# Altium schematic sheet PMIC_Debug.SchDoc
size 420 x 297 mm; SheetNumber: 15; SheetTotal: 21
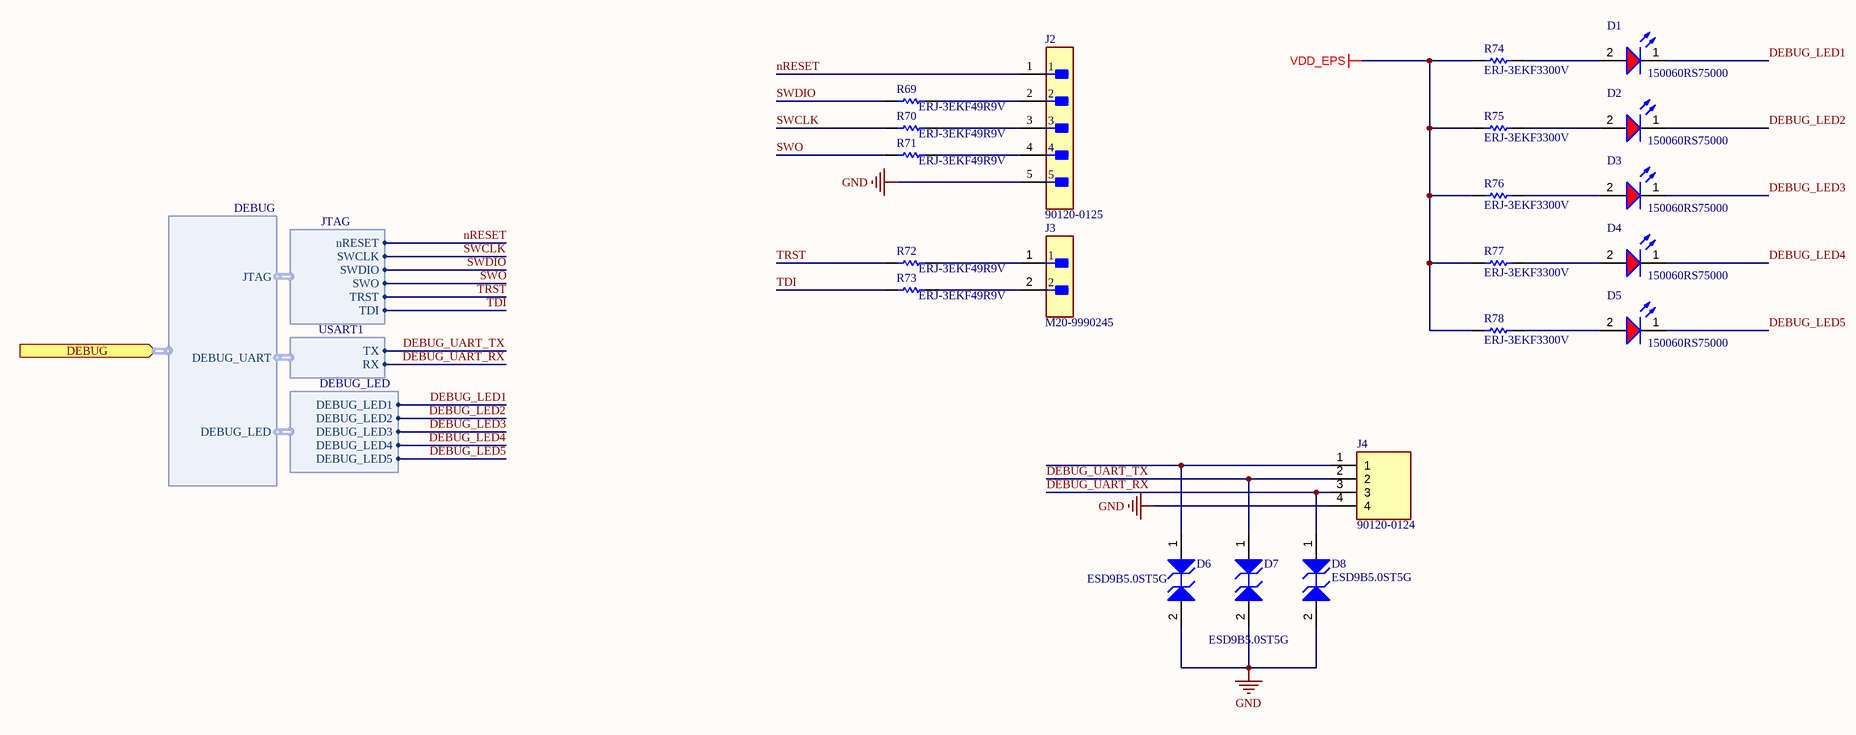
[diagram p0: PMIC_Debug.SchDoc]

## Parts
D1  150060RS75000  [WL-SMCW_0603_150060xx75000]
D2  150060RS75000  [WL-SMCW_0603_150060xx75000]
D3  150060RS75000  [WL-SMCW_0603_150060xx75000]
D4  150060RS75000  [WL-SMCW_0603_150060xx75000]
D5  150060RS75000  [WL-SMCW_0603_150060xx75000]
D6  ESD9B5.0ST5G  [ONSC-SOD-923-2-514AB-01_V]
D7  ESD9B5.0ST5G  [ONSC-SOD-923-2-514AB-01_V]
D8  ESD9B5.0ST5G  [ONSC-SOD-923-2-514AB-01_V]
J2  90120-0125  [FP-90120-0125-MFG]
J3  M20-9990245  [FP-M20-9990245-MFG]
J4  90120-0124  [HDRV4W65P0X254_1X4_1016X254X945P]
R69  ERJ-3EKF49R9V  [RESC1608X55X30ML15T15]
R70  ERJ-3EKF49R9V  [RESC1608X55X30ML15T15]
R71  ERJ-3EKF49R9V  [RESC1608X55X30ML15T15]
R72  ERJ-3EKF49R9V  [RESC1608X55X30ML15T15]
R73  ERJ-3EKF49R9V  [RESC1608X55X30ML15T15]
R74  ERJ-3EKF3300V  [RESC1608X55X30LL15T15]
R75  ERJ-3EKF3300V  [RESC1608X55X30LL15T15]
R76  ERJ-3EKF3300V  [RESC1608X55X30LL15T15]
R77  ERJ-3EKF3300V  [RESC1608X55X30LL15T15]
R78  ERJ-3EKF3300V  [RESC1608X55X30LL15T15]

## Ports
DEBUG (in, harness DEBUG)

## Harnesses
DEBUG: JTAG, DEBUG_UART, DEBUG_LED
JTAG: nRESET, SWCLK, SWDIO, SWO, TDI, TRST
USART1: TX, RX
DEBUG_LED: DEBUG_LED1, DEBUG_LED2, DEBUG_LED3, DEBUG_LED4, DEBUG_LED5

## Nets
GND: D6.2(A2) D7.2(A2) D8.2(A2) J2.5 J4.4
VDD_EPS: R74.1 R75.1 R76.1 R77.1 R78.1
DEBUG_LED1: D1.1(K) ; harness DEBUG_LED.DEBUG_LED1
DEBUG_LED2: D2.1(K) ; harness DEBUG_LED.DEBUG_LED2
DEBUG_LED3: D3.1(K) ; harness DEBUG_LED.DEBUG_LED3
DEBUG_LED4: D4.1(K) ; harness DEBUG_LED.DEBUG_LED4
DEBUG_LED5: D5.1(K) ; harness DEBUG_LED.DEBUG_LED5
DEBUG_UART_RX: D8.1(A1) J4.3 ; harness USART1.RX
DEBUG_UART_TX: D7.1(A1) J4.2 ; harness USART1.TX
nRESET: J2.1 ; harness JTAG.nRESET
SWCLK: R70.1 ; harness JTAG.SWCLK
SWDIO: R69.1 ; harness JTAG.SWDIO
SWO: R71.1 ; harness JTAG.SWO
TDI: R73.1 ; harness JTAG.TDI
TRST: R72.1 ; harness JTAG.TRST
NetD1_2: D1.2(A) R74.2
NetD2_2: D2.2(A) R75.2
NetD3_2: D3.2(A) R76.2
NetD4_2: D4.2(A) R77.2
NetD5_2: D5.2(A) R78.2
NetD6_1: D6.1(A1) J4.1
NetJ2_2: J2.2 R69.2
NetJ2_3: J2.3 R70.2
NetJ2_4: J2.4 R71.2
NetJ3_1: J3.1 R72.2
NetJ3_2: J3.2 R73.2

## Notes on the sheet
- THIS DOCUMENT AND THE DATA DISCLOSED HEREIN OR
- HEREWITH IS THE PROPERTY OF ALTIUM LIMITED AND MAY
- DWG NO:
- REVISION
- REV:
- DESCRIPTION
- DATE
- APPROVED
- BE FREELY DISTRIBUTED IN WHOLE. NO RIGHTS ARE
- RESERVED OR EXPRESS OR IMPLIED WARANTEE GIVEN.
- ENG:
- APPROVALS
- PROJECT
- DSN:
- CHK:
- REFERENCE DOCUMENTS
- PROJECT REVISION:
- TITLE
- DOCUMENT REVISION:
- DESIGN ITEM:
- BOM:
- FAB DWG:
- PCB DWG:
- ASSY DWG:
- SCALE:
- A3
- SIZE
- CAGE CODE
- FILE NAME
- DWG NO.
- SHEET
- OF
- REV

## Library data of the parts
D1-D5 = CMP-1426-00001-4: LED Low-Power Uni-Color Red 630nm 2V 2-Pin Chip 0603(1608Metric) T/R; Max Junction Temperature (Tj): 95°C; Dominant Wavelength: 625nm; Lens Style: Clear, Rectangular; Viewing Angle: 140°; Forward Current: 100mA; Max Reverse Voltage (DC): 5V; Luminous Intensity: 250mcd; Test Current: 20mA; Power Dissipation: 72mW; Max Operating Temperature: 85°C; Mount: Surface Mount; Height: 700µm; Packaging: Tape and Reel; REACH SVHC: Unknown; Case Code (Metric): 1608; Peak Wavelength: 630nm; Forward Voltage: 2V; Case/Package: 0603; Color: Red; RoHS: Compliant; Width: 800µm; Reverse Voltage: 5V; Min Operating Temperature: -40°C; Wavelength: 625nm; Case Code (Imperial): 0603; Length: 1.6mm
D6-D8 = CMP-1063-00119-1: Transient Voltage Suppressor, Micro-Packaged Diode for ESD Protection, 2-Pin SOD-923, Pb-Free, Tape and Reel; Manufacturer: On Semiconductor; Number of Lines: 1; Direction: Bidirectional; V(BR) Min (V): 5.8; VRWM Max (V): 5; Packing: Tape and Reel; PackageDescription: 2-Pin SOD, Body 0.8 x 0.6 mm; IR Max (uA): 1; ComponentLink3Description: Package Specification; PartNumber: ESD9B5.0ST5G; ComponentLink1URL: http://www.onsemi.com/; RoHS: Pb-Free; Mounting Technology: Surface Mount; DatasheetVersion: Rev. 2; ComponentLink2URL: http://www.onsemi.cn/pub_link/Collateral/ESD9B-D.PDF; ComponentLink3URL: http://www.onsemi.com/pub_link/Collateral/514AB.PDF; PackageReference: SOD-923-2-514AB-01; PackageVersion: Rev. C, 03/2011; ComponentLink1Description: Manufacturer URL; ComponentLink2Description: Datasheet
J2 = CMP-00257-00655425-1: 90120-0125 2.54mm Pitch C-Grid III Header, Single Row, Vertical, 5 Circuits, Tin (Sn) Plating; NexarPartId: 655425; Manufacturer Lifecycle Status: ACTIVE; Lead Length: 2.9mm; Number of Positions: 5; Current Rating: 3A; Mating Post Length: 6.75mm; Glow Wire Compliant: Non-compliant; Contact Resistance: 20mΩ; Voltage Rating: 350V; Gender: Male; Max Voltage Rating (DC): 350.35kV; Max Operating Temperature: 125°C; Number of Pins: 5; Plating: Tin; Contact Material: Brass; Mount: Through Hole; Contact Gender: Male; Packaging: Bulk; Schedule B: 8536694040; Lifecycle Status: Production; Lead Pitch: 2.54mm; Radiation Hardening: No; Orientation: Vertical; Min Operating Temperature: -55°C; Country of Origin: SK; Housing Color: Black; REACH SVHC: No SVHC; Contact Plating: Tin; Number of Rows: 1; Number of Circuits: 5; Termination: Solder; Number of Contacts: 5; Pitch: 2.54mm; Housing Material: Polyester; RoHS: Compliant; Lead Free: Lead Free; Voltage Rating (AC): 350V
J3 = CMP-15831-000105-1: CONN HEADER VERT 2POS 2.54MM; Working Voltage: 750V; Gender: Male; Number of Poles: 2; Current Rating: 3A; Mated Stacking Heights: 16.54mm; Contact Resistance: 25mR; Connector Type: Male Pin; Insulation Resistance: 10GR; Mating Cycles: 300; Voltage: 50V; Flammability Rating: UL94 V-0; Pitch: 2.54mm; Series: M20; Number of Contacts: 2; Height: 0.12inch; Min Operating Temperature: -40°C; Contact Finish - Mating: GOLD; Number of Positions: 2; Number of Rows: 1; Packaging: Bulk; Package Quantity: 1000; Voltage Rating (AC): 750V; Current: 3A; Mount: Through Hole; Case/Package: SIL; Orientation: Straight; Contact Shape: Square; Weight: 0.25lb; Radiation Hardening: No; Fastening Type: Pull; Length: 5.08mm; Depth: 2.54mm; Contact Mating Length: 0.24inch; Housing Material: Nylon; Reach SVHC Compliant: Yes; Insulation Material: Nylon; Color: Black; Width: 0.25inch; Insulation Color: Black; Contact Material: Brass; Contact Type: Male Pin; Termination: Solder; Max Operating Temperature: 105°C; Contact Plating: Gold; Housing Color: Black; Max Current Rating: 3A; Lead Pitch: 2.54mm
J4 = 90120-0124: Connector; Manufacturer_Name: Molex; Datasheet Link: https://componentsearchengine.com/Datasheets/2/90120-0124.pdf; Height: 9.45mm; Manufacturer_Part_Number: 90120-0124; Mouser Part Number: 538-90120-0124; Mouser Price/Stock: https://www.mouser.co.uk/ProductDetail/Molex/90120-0124?qs=PvP5v7EimsmprSEogp1JLQ%3D%3D
R69-R73 = CMP-2000-00538-1: Manufacturer: Panasonic; Part Number: ERJ-3EKF49R9V
R74-R78 = CMP-2000-00435-2: Chip Resistor, 330 Ohm, +/- 1%, 0.1 W, -55 to 155 degC, 0603 (1608 Metric), RoHS, Tape and Reel; Gender: Male; Mating Cycles: 10000; Current Rating: 500 mA; Voltage Rating: 10 V; REACH SVHC: No SVHC; PackageDescription: 2-Pin Surface Mount Device, Body 1.6 x 0.85 mm; Contact Finish: Gold; Pins: 8; ComponentLink1Description: Manufacturer URL; Packaging: Tape and Reel; Max Operating Temperature: 85 degC; Contact Material: Copper; Height: 1.45 mm; Width: 1.45 mm; DatasheetVersion: Apr-15; Package Quantity: 1500; Contact Plating: Gold; PackageReference: 0603; Mount: Surface Mount; Lead Pitch: 1.1 mm; Min Operating Temperature: -25 degC; ComponentLink1URL: http://www.panasonic.com/; ComponentLink2URL: http://industrial.panasonic.com/cdbs/www-data/pdf/RDA0000/AOA0000C86.pdf; Length: 13.7 mm; ComponentLink2Description: Datasheet; RoHSCompliant: true